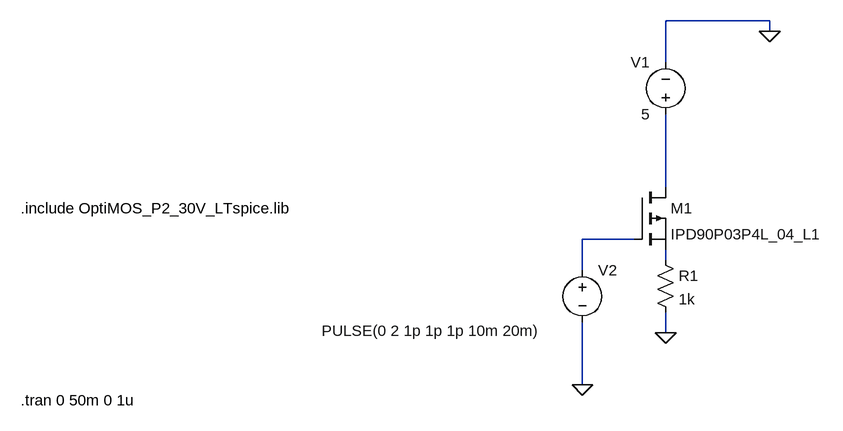
[diagram p0: schematic otraprueba.asc]
otraprueba.asc, the LTspice schematic file:
Version 4.1
SHEET 1 1064 680
WIRE 960 -304 800 -304
WIRE 960 -288 960 -304
WIRE 800 -240 800 -304
WIRE 800 -48 800 -160
WIRE 752 32 672 32
WIRE 800 64 800 48
WIRE 672 80 672 32
WIRE 800 176 800 144
WIRE 672 256 672 160
FLAG 672 256 0
FLAG 800 176 0
FLAG 960 -288 0
SYMBOL pmos 752 -48 R0
SYMATTR InstName M1
SYMATTR Value IPD90P03P4L_04_L1
SYMATTR Prefix X
SYMBOL voltage 800 -144 R180
WINDOW 0 24 96 Left 2
WINDOW 3 24 16 Left 2
WINDOW 123 0 0 Left 0
WINDOW 39 0 0 Left 0
SYMATTR InstName V1
SYMATTR Value 5
SYMBOL voltage 672 64 R0
WINDOW 3 -401 109 Left 2
WINDOW 123 0 0 Left 0
WINDOW 39 0 0 Left 0
SYMATTR InstName V2
SYMATTR Value PULSE(0 2 1p 1p 1p 10m 20m)
SYMBOL res 784 48 R0
SYMATTR InstName R1
SYMATTR Value 1k
TEXT -192 -16 Left 2 !.include OptiMOS_P2_30V_LTspice.lib
TEXT -192 280 Left 2 !.tran 0 50m 0 1u

The netlist it stands for:
* otraprueba.asc
X§M1 N001 N002 N003 IPD90P03P4L_04_L1  ; pins D G S
V1 N001 0 5
V2 N002 0 PULSE(0 2 1p 1p 1p 10m 20m)
R1 N003 0 1k
.include OptiMOS_P2_30V_LTspice.lib
.tran 0 50m 0 1u
.backanno
.end